# EAGLE design wiiceiver v2 (EAGLE 7.1.0)
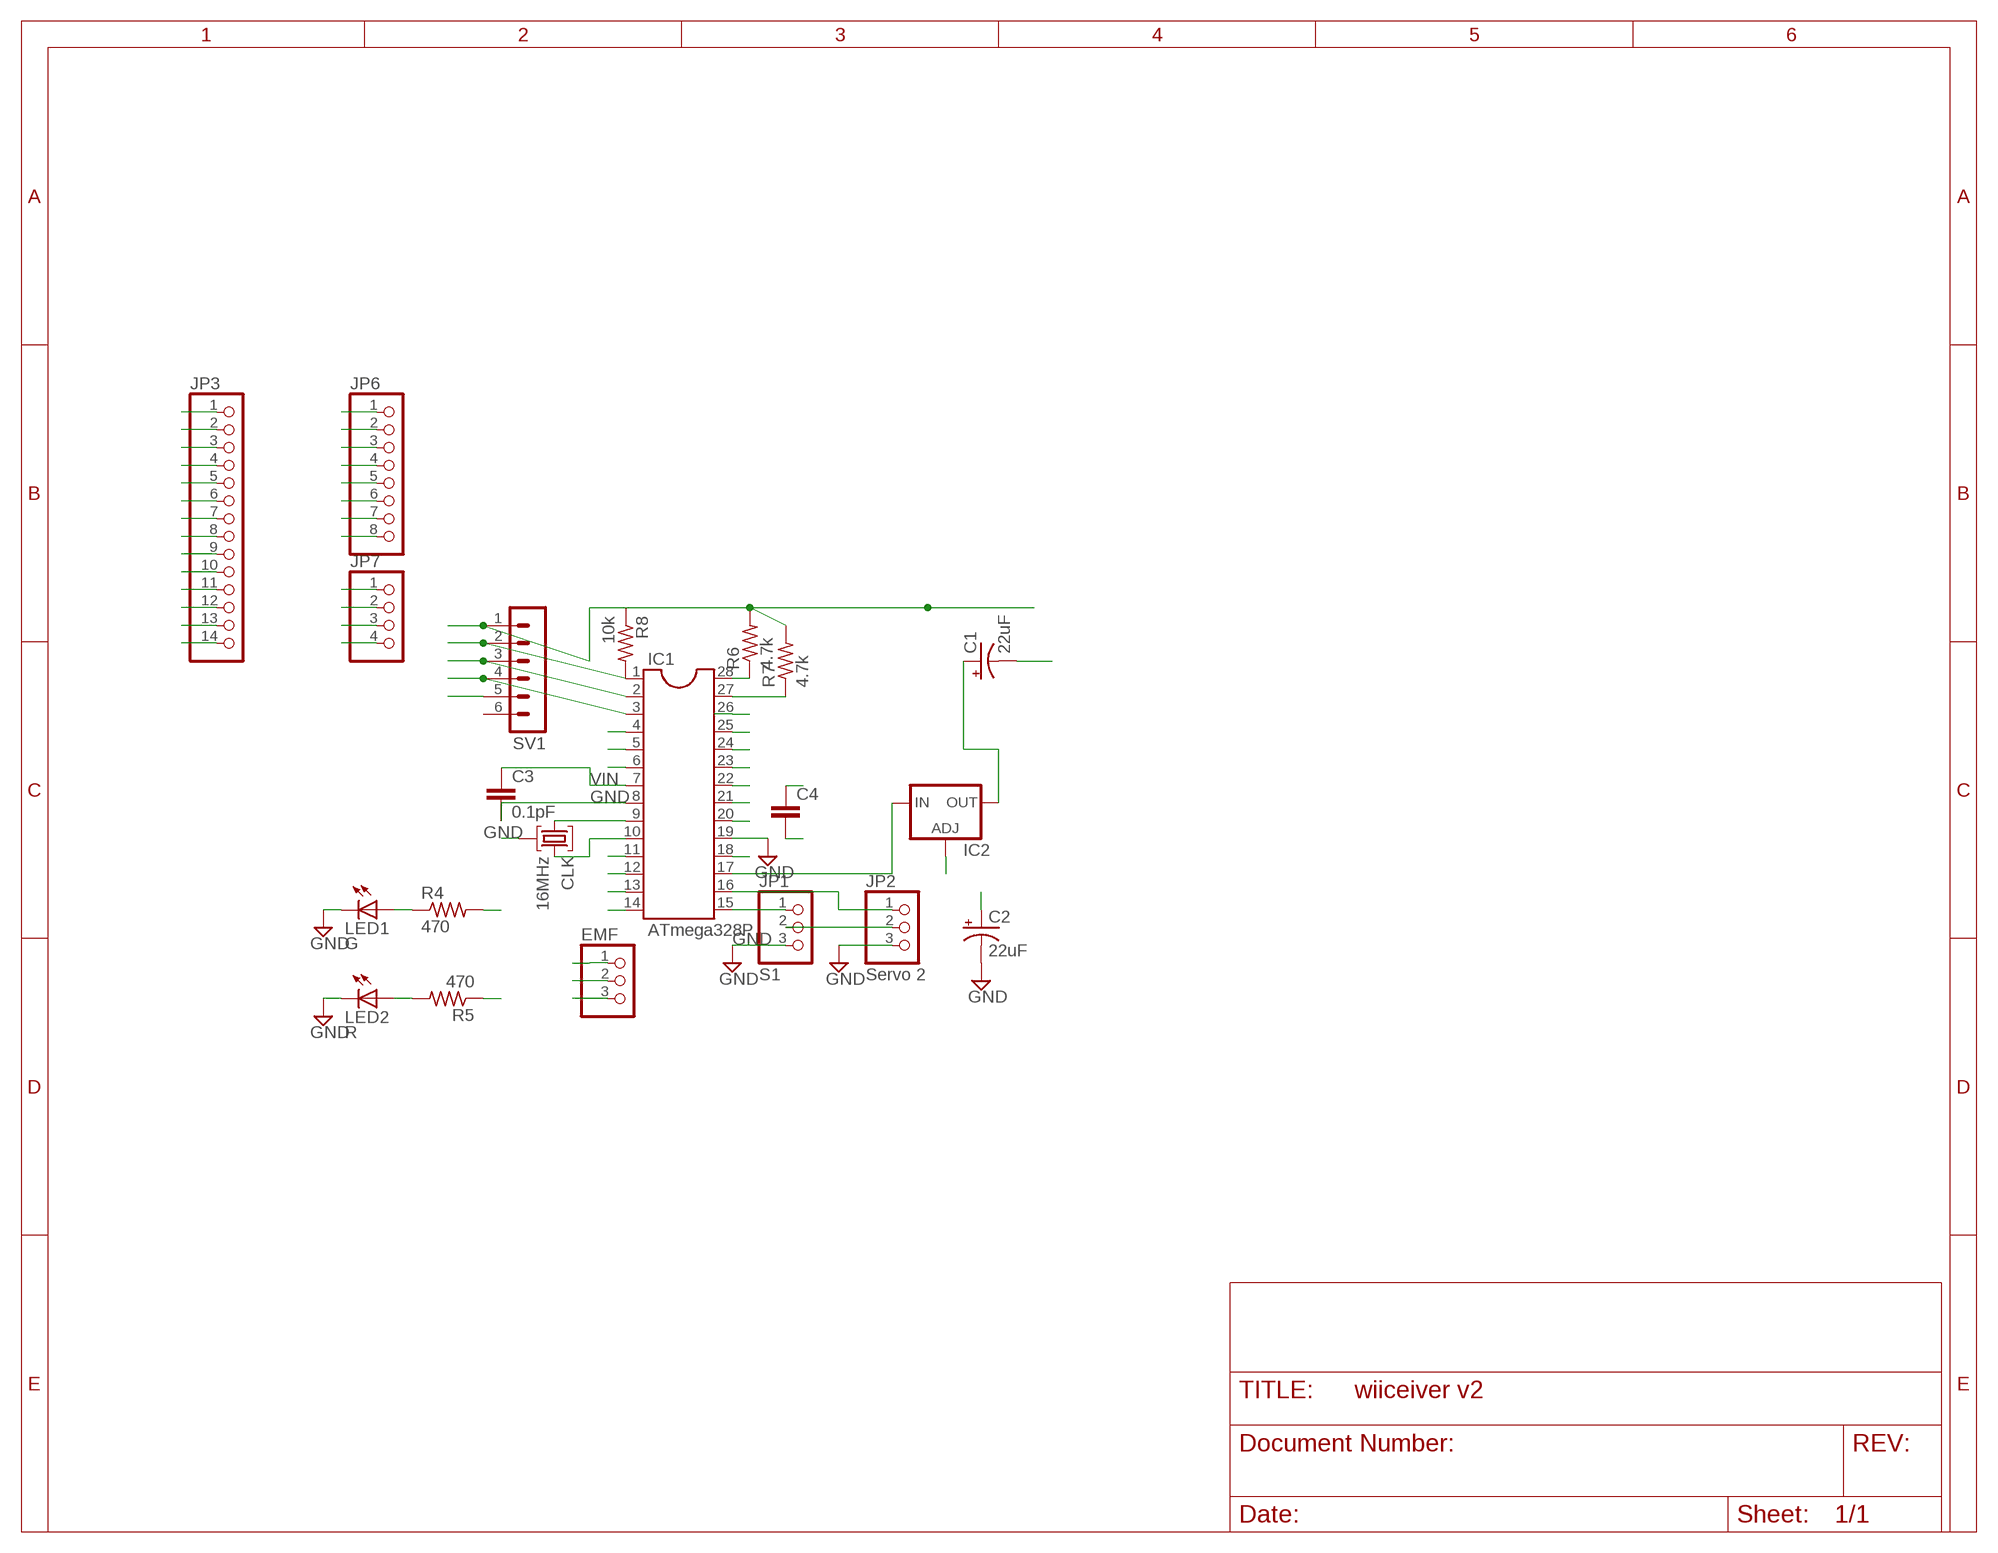
[diagram p0: schematic, sheet 1]

## Parts
C1  22uF  CPOL-USB45181A  [B45181A]
C2  22uF  CPOL-USB45181A  [B45181A]
C3  0.1pF  C5/2.5  [C5B2.5]
C4  C5/2.5  [C5B2.5]
CLK  16MHz  IXFA  [HC49U]
EMF  PINHD-1X3  [1X03]
IC1  ATmega328P  DIL28-3  [DIL28-3]
IC2  LM317TS  [317TS]
JP1  S1  PINHD-1X3  [1X03]
JP2  Servo 2  PINHD-1X3  [1X03]
JP3  PINHD-1X14  [1X14]
JP6  PINHD-1X8  [1X08]
JP7  PINHD-1X4  [1X04]
LED1  G  LED3MM  [LED3MM]
LED2  R  LED3MM  [LED3MM]
R4  470  R-US_0204/2V  [0204V]
R5  470  R-US_0204/2V  [0204V]
R6  4.7k  R-US_0204/2V  [0204V]
R7  4.7k  R-US_0204/2V  [0204V]
R8  10k  R-US_0204/2V  [0204V]
SV1  MA06-1  [MA06-1]

## Nets
A0: IC1.23 JP3.6
A1: IC1.24 JP3.5
A2: IC1.25 JP3.4
A3: IC1.26 JP3.3
A4: IC1.27 JP3.2 R7.1
A5: IC1.28 JP3.1 R6.1
D0: IC1.2 JP6.2 SV1.3
D1: IC1.3 JP6.3 SV1.4
D2: IC1.4 JP6.4
D3: IC1.5 JP6.5
D4: IC1.6 JP6.6
D5: IC1.11 JP7.1
D6: IC1.12 JP7.2 R4.2
D7: IC1.13 JP7.3
D8: IC1.14 JP7.4 R5.1
D9: IC1.15 JP1.1 JP3.14
D10: IC1.16 JP2.1 JP3.13
D11: IC1.17 IC2.3(IN) JP3.12
D12: IC1.18 JP3.11
D13: JP3.10
GND: C1.- C2.- C3.2 C4.2 CLK.2 EMF.2 IC1.8 IC1.19 IC1.22 IC2.1(ADJ) JP1.3 JP2.3 JP3.7 JP6.8 LED1.K(C) LED2.K(C) SV1.5
N$1: LED2.A R5.2
N$2: LED1.A R4.1
N$3: CLK.3 IC1.10
N$11: CLK.1 IC1.9
N$16: C1.+ IC2.2(OUT)
RST: IC1.1 JP6.1 R8.2 SV1.2
VIN: C3.1 C4.1 EMF.3 IC1.7 IC1.20 IC1.21 JP3.8 JP3.9 JP6.7 R6.2 R7.2 R8.1 SV1.1
VRAW: C2.+ EMF.1 JP1.2 JP2.2
Unconnected: SV1.6

## Library data of the parts
C1 C2 = resistor:CPOL-US: POLARIZED CAPACITOR, American symbol
C3 C4 = capacitor-wima:C: CAPACITOR naming: grid - package width
CLK = crystal:IXF: Crystal Filter Source: www.ilsiamerica.com .. C1 IXF Series.pdf; OC_FARNELL: unknown; OC_NEWARK: unknown
EMF JP1 JP2 = pinhead:PINHD-1X3: PIN HEADER
IC1 = ic-package:DIL28: Dual In Line
IC2 = v-reg:LM317TS: VOLTAGE REGULATOR
JP3 = pinhead:PINHD-1X14: PIN HEADER
JP6 = pinhead:PINHD-1X8: PIN HEADER
JP7 = pinhead:PINHD-1X4: PIN HEADER
LED1 LED2 = led:LED: LED OSRAM: - CHIPLED LG R971, LG N971, LY N971, LG Q971, LY Q971, LO R971, LY R971 LH N974, LH R974 LS Q976, LO Q976, LY Q976 LO Q996 - Hyper CHIPLED LW Q18S LB Q993, LB Q99A, LB R99A - SideLED LS A670, LO A670, LY A670, LG A670, LP A670 LB A673, LV A673, LT A673, LW A673 LH A674 LY A675 LS A676, LA A676, LO A676, LY A676, LW A676 LS A679, LY A679, LG A679 - Hyper Micro SIDELED® LS Y876, LA Y876, LO Y876, LY Y876 LT Y87S - SmartLED LW L88C, LW L88S LB L89C, LB L89S, LG L890 LS L89K, LO L89K, LY L89K LS L896, LA L896, LO L896, LY L896 - TOPLED LS T670, LO T670, LY T670, LG T670, LP T670 LSG T670, LSP T670, LSY T670, LOP T670, LYG T670 LG T671, LOG T671, LSG T671 LB T673, LV T673, LT T673, LW T673 LH T674 LS T676, LA T676, LO T676, LY T676, LB T676, LH T676, LSB T676, LW T676 LB T67C, LV T67C, LT T67C, LS T67K, LO T67K, LY T67K, LW E67C LS E67B, LA E67B, LO E67B, LY E67B, LB E67C, LV E67C, LT E67C LW T67C LS T679, LY T679, LG T679 LS T770, LO T770, LY T770, LG T770, LP T770 LB T773, LV T773, LT T773, LW T773 LH T774 LS E675, LA E675, LY E675, LS T675 LS T776, LA T776, LO T776, LY T776, LB T776 LHGB T686 LT T68C, LB T68C - Hyper Mini TOPLED® LB M676 - Mini TOPLED Santana® LG M470 LS M47K, LO M47K, LY M47K Source: http://www.osram.convergy.de LUXEON: - LUMILED® LXK2-PW12-R00, LXK2-PW12-S00, LXK2-PW14-U00, LXK2-PW14-V00 LXK2-PM12-R00, LXK2-PM12-S00, LXK2-PM14-U00 LXK2-PE12-Q00, LXK2-PE12-R00, LXK2-PE12-S00, LXK2-PE14-T00, LXK2-PE14-U00 LXK2-PB12-K00, LXK2-PB12-L00, LXK2-PB12-M00, LXK2-PB14-N00, LXK2-PB14-P00, LXK2-PB14-Q00 LXK2-PR12-L00, LXK2-PR12-M00, LXK2-PR14-Q00, LXK2-PR14-R00 LXK2-PD12-Q00, LXK2-PD12-R00, LXK2-PD12-S00 LXK2-PH12-R00, LXK2-PH12-S00 LXK2-PL12-P00, LXK2-PL12-Q00, LXK2-PL12-R00 Source: www.luxeon.com KINGBRIGHT: KA-3528ASYC Source: www.kingbright.com
R4-R8 = resistor:R-US_: RESISTOR, American symbol
SV1 = con-lstb:MA06-1: PIN HEADER; OC_FARNELL: unknown; OC_NEWARK: unknown

## Net classes
0 default: clearance 0.205 mm

## Board
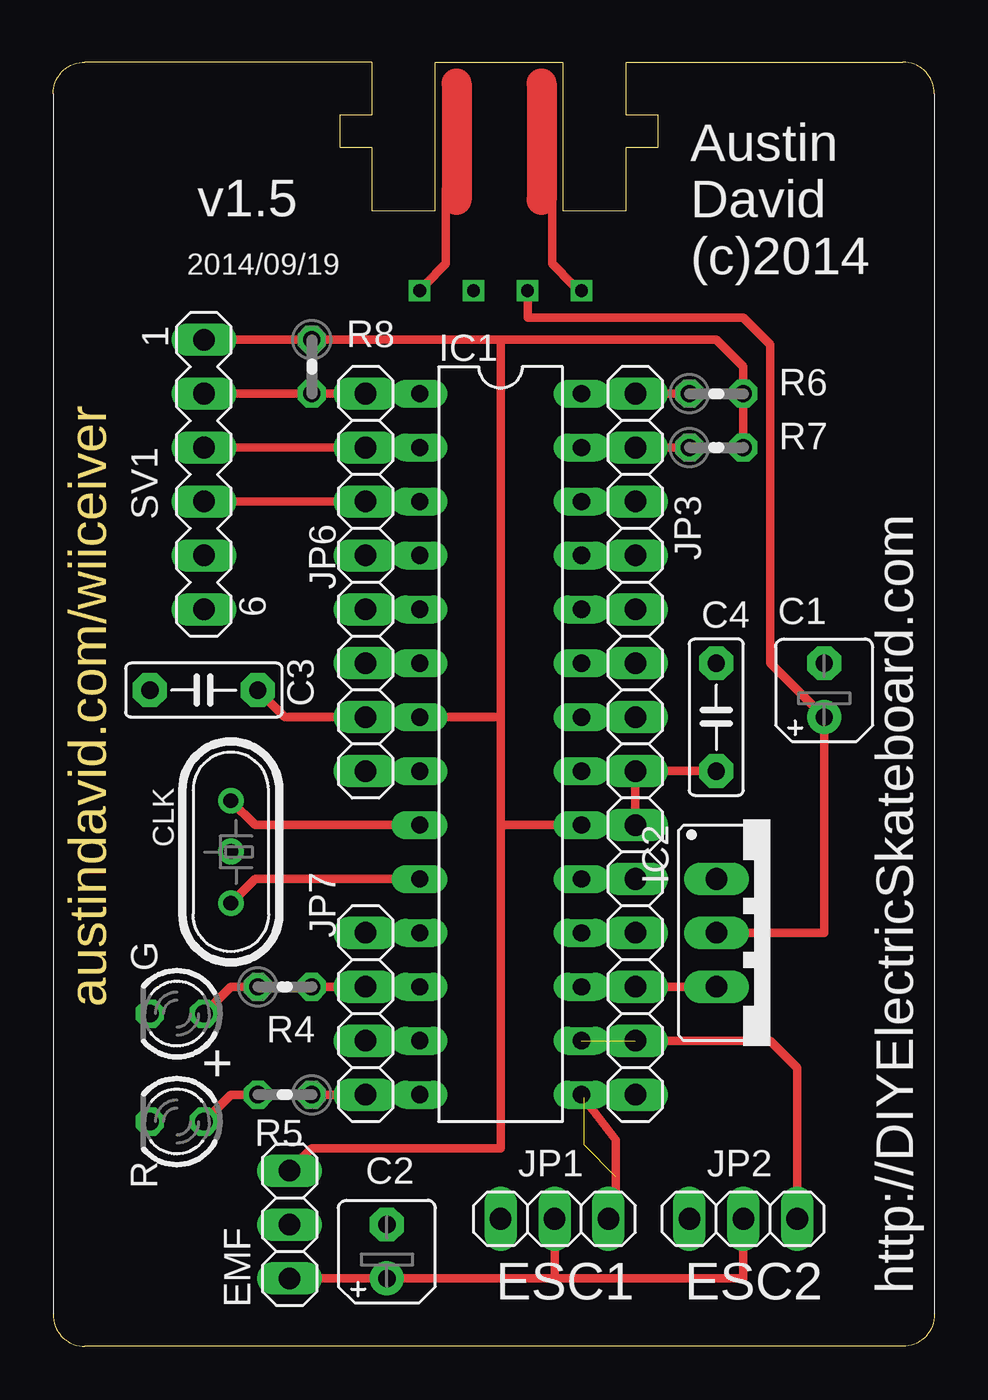
[diagram p1: board, top side]
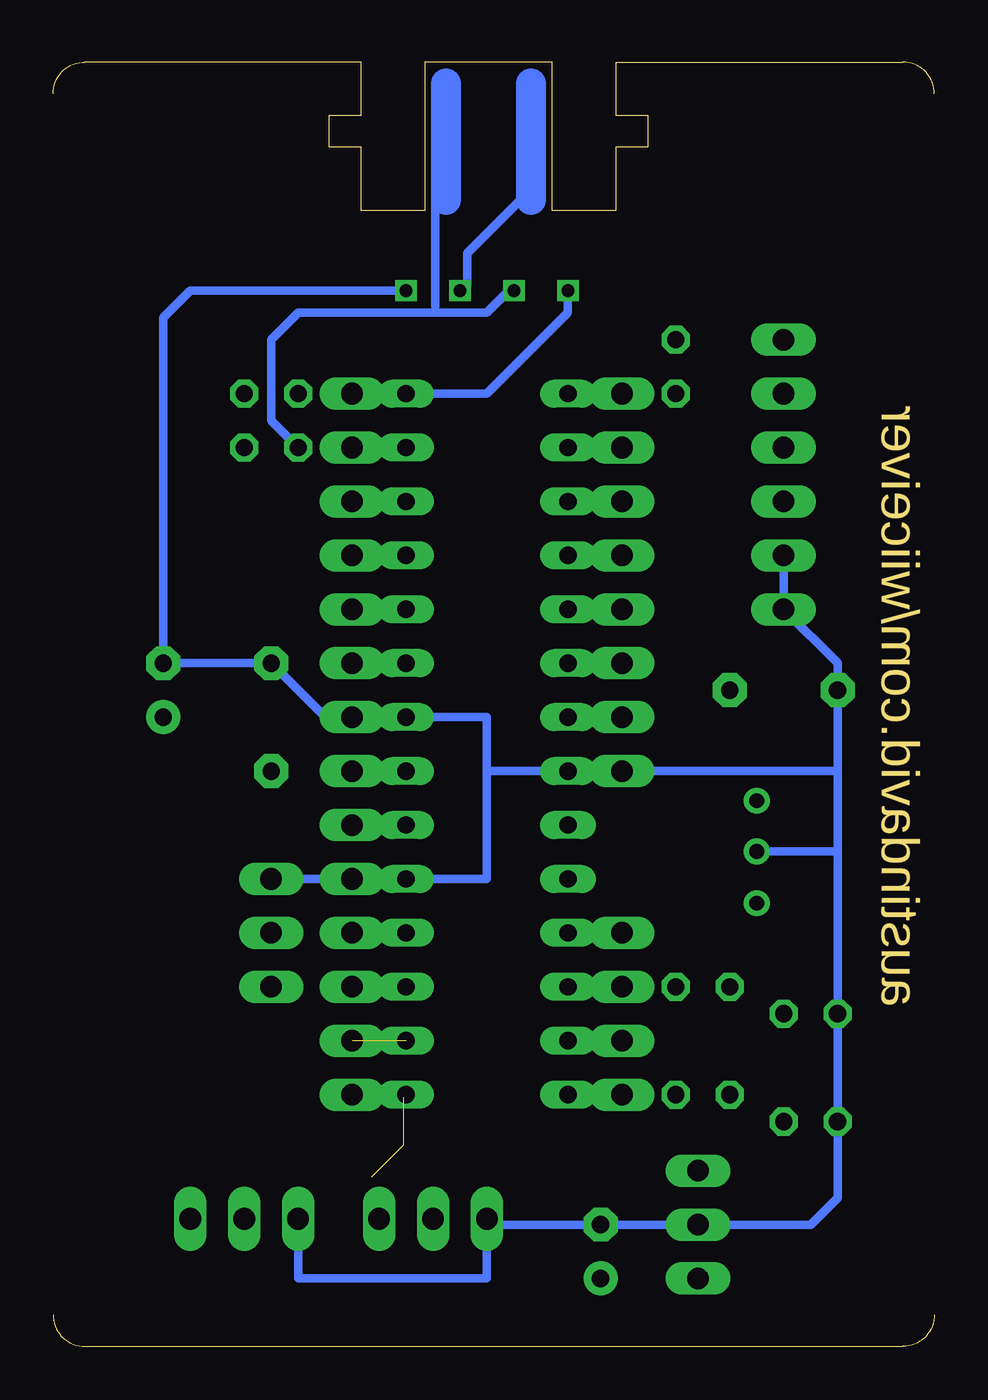
[diagram p2: board, bottom side, seen from below]

Size 41.5 x 60.5 mm. Coordinates in mm from the lower left corner, seen from the top.
Outline: 41.5,1.5 arc-90 40,0 1.5,0 arc-90 0,1.5
Outline: 0,59 arc-90 1.5,60.5 15,60.5 15,58 13.5,58 13.5,56.5 15,56.5 15,53.5 18,53.5 18,60.5 24,60.5 24,53.5 27,53.5 27,56.5 28.5,56.5 28.5,58 27,58 27,60.5 40,60.5 arc-90 41.5,59
Copper layers (1*16): Top 0.035mm / dielectric 1.5mm / Bottom 0.035mm
Design rules "default": minimum track width 10mil, minimum drill 24mil, track to track 8mil, track to pad 8mil, pad to pad 8mil, via to via 8mil, smd to smd 8mil, copper to edge 40mil, drill to drill 8mil, minimum pad ring 10mil, minimum via ring 8mil, stop-mask expansion 4mil, vias tented up to drill 0mil, thermal gap 10mil

### Footprints (pad centres in the part's own frame; a part is rotated, then mirrored left to right if it is on the bottom)
B45181A = drill 0.813 pad 1.6: + -1.27,0 | drill 0.813 pad 1.6 octagon: - 1.27,0
C5B2.5 = drill 0.813 pad 1.6 octagon: 1 -2.54,0; 2 2.54,0
HC49U = drill 0.7 pad 1.2: 1 -2.413,0; 2 -0.027,0; 3 2.413,0
1X03 = drill 1.016 long: 1 -2.54,0; 2 0,0; 3 2.54,0
DIL28-3 = drill 0.813 long: 1 -16.51,-3.81; 2 -13.97,-3.81; 3 -11.43,-3.81; 4 -8.89,-3.81; 5 -6.35,-3.81; 6 -3.81,-3.81; 7 -1.27,-3.81; 8 1.27,-3.81; 9 3.81,-3.81; 10 6.35,-3.81; 11 8.89,-3.81; 12 11.43,-3.81; 13 13.97,-3.81; 14 16.51,-3.81; 15 16.51,3.81; 16 13.97,3.81; 17 11.43,3.81; 18 8.89,3.81; 19 6.35,3.81; 20 3.81,3.81; 21 1.27,3.81; 22 -1.27,3.81; 23 -3.81,3.81; 24 -6.35,3.81; 25 -8.89,3.81; 26 -11.43,3.81; 27 -13.97,3.81; 28 -16.51,3.81
317TS = drill 1.016 long: 1 -2.54,-2.54; 2 0,-2.54; 3 2.54,-2.54
1X14 = drill 1.016 long: 1 -16.51,0; 2 -13.97,0; 3 -11.43,0; 4 -8.89,0; 5 -6.35,0; 6 -3.81,0; 7 -1.27,0; 8 1.27,0; 9 3.81,0; 10 6.35,0; 11 8.89,0; 12 11.43,0; 13 13.97,0; 14 16.51,0
1X08 = drill 1.016 long: 1 -8.89,0; 2 -6.35,0; 3 -3.81,0; 4 -1.27,0; 5 1.27,0; 6 3.81,0; 7 6.35,0; 8 8.89,0
1X04 = drill 1.016 long: 1 -3.81,0; 2 -1.27,0; 3 1.27,0; 4 3.81,0
LED3MM = drill 0.813 octagon: A -1.27,0; K 1.27,0
0204V = drill 0.813 octagon: 1 -1.27,0; 2 1.27,0
MA06-1 = drill 1.016 long: 1 -6.35,0; 2 -3.81,0; 3 -1.27,0; 4 1.27,0; 5 3.81,0; 6 6.35,0

### Placement (x,y rotation side)
C1  36.31,30.91 90 top
C2  15.72,4.47 90 top
C3  7.1,30.91 180 top
C4  31.23,29.64 90 top
CLK  8.37,23.29 270 top
EMF  11.14,5.74 90 top
IC1  21.07,28.37 270 top
IC2  33.77,19.48 270 top
JP1  23.61,6.01 180 top
JP2  32.5,6.01 180 top
JP3  27.42,28.37 270 top
JP6  14.72,35.99 270 top
JP7  14.72,15.67 270 top
LED1  5.83,15.67 180 top
LED2  5.83,10.59 180 top
R4  10.91,16.94 0 top
R5  10.91,11.86 180 top
R6  31.23,44.88 0 top
R7  31.23,42.34 0 top
R8  12.18,46.15 270 top
SV1  7.1,41.07 270 top

### Tracks (layer width: path | path; a pad name or v marks a point on that pad's centre or on a via)
A0
  Top 0.406: IC1.23 JP3.6
A1
  Top 0.406: IC1.24 JP3.5
A2
  Top 0.406: IC1.25 JP3.4
A3
  Top 0.406: IC1.26 JP3.3
A4  (via drill 0.6)
  Top 0.406: R7.1 JP3.2 IC1.27
  Bottom 0.406: R7.1 31.23,43.61 31.23,47.42 29.96,48.69 21.07,48.69 19.8,49.96 v19.8,49.73
A5  (via drill 0.6)
  Top 0.406: IC1.28 JP3.1 R6.1
  Bottom 0.406: IC1.28 21.07,44.88 17.26,48.69 v17.26,49.73
D0
  Top 0.406: IC1.2 JP6.2 SV1.3
D1
  Top 0.406: IC1.3 JP6.3 SV1.4
D2
  Top 0.406: IC1.4 JP6.4
D3
  Top 0.406: IC1.5 JP6.5
D4
  Top 0.406: IC1.6 JP6.6
D5
  Top 0.406: IC1.11 JP7.1
D6
  Top 0.406: IC1.12 JP7.2 R4.2
D7
  Top 0.406: IC1.13 JP7.3
D8
  Top 0.406: IC1.14 JP7.4 R5.1
D9  (3 unrouted)
  Top 0.406: IC1.15 JP3.14 | 25,11.74 IC1.15 | 26.5,5.51 26.5,9.74 IC1.15
  Bottom 0.406: JP1.1 26.5,5.51
D10  (1 unrouted)
  Top 0.406: JP3.13 33.77,14.4 35.04,13.13 JP2.1
D11
  Top 0.406: IC1.17 JP3.12 IC2.3
D12
  Top 0.406: IC1.18 JP3.11
GND  (via drill 0.6)
  Top 0.406: IC1.8 JP6.8 | IC1.19 27.42,22.02
  Bottom 0.406: IC1.8 21.07,27.1 | JP6.8 4.56,27.1 | 4.56,27.1 C3.2 4.56,32.18 7.1,34.72 SV1.5 | CLK.2 4.59,23.32 4.56,23.29 | 4.56,23.29 4.56,27.1 | 4.56,23.29 LED1.K LED2.K 4.56,7.01 5.83,5.74 EMF.2 C2.- 21.07,5.74 | IC2.1 IC1.19 21.07,22.02 21.07,27.1 | 21.07,27.1 21.07,29.64 IC1.22 JP3.7 28.69,29.64 C4.2 C1.- 36.31,48.46 35.04,49.73 v24.88,49.73 | JP2.3 29.96,3.2 21.07,3.2 21.07,5.74 | 21.07,5.74 JP1.3
N$1
  Top 0.406: R5.2 8.37,11.86 LED2.A
N$2
  Top 0.406: R4.1 8.37,16.94 LED1.A
N$3
  Top 0.406: IC1.10 9.51,22.02 CLK.3
N$4
  Top 1.422: 19,59.5 19,54
N$5
  Bottom 1.422: 19,59.5 19,54
N$6
  Top 1.422: 23,59.5 23,54
N$7
  Bottom 1.422: 23,59.5 23,54
N$8
  Top 0.406: 17.5,50 18.5,51 18.5,54.5
N$9
  Top 0.406: 24.5,50 23.5,51 23.5,55.5
N$10
  Bottom 0.406: 22,50 22,51.5 19.5,54
N$11
  Top 0.406: IC1.9 9.51,24.56 CLK.1
N$13
  Bottom 0.406: 23.5,49 23.5,54
N$16  (via drill 0.6)
  Top 0.406: IC2.2 36.31,19.48 C1.+ 33.77,32.18 33.77,47.19 32.5,48.46 22.34,48.46 v22.34,49.73
RST
  Top 0.406: IC1.1 JP6.1 R8.2 SV1.2
VIN
  Top 0.406: SV1.1 R8.1 21.07,47.42 | R7.2 R6.2 32.5,46.15 31.23,47.42 21.07,47.42 | C4.1 JP3.8 | JP3.8 IC1.21 | JP3.8 JP3.9 IC1.20 21.07,24.56 | C3.1 10.91,29.64 JP6.7 IC1.7 21.07,29.64 | EMF.3 12.18,9.32 21.07,9.32 21.07,24.56 | 21.07,24.56 21.07,29.64 | 21.07,47.42 21.07,29.64
VRAW
  Top 0.406: 23.61,3.2 C2.+ EMF.1 | 23.61,3.2 JP1.2 | JP2.2 32.5,3.2 23.61,3.2

### Text on the board
Dimension: austindavid.com/wiiceiver
tNames: v1.5 | 2014/09/19 | Austin / David / (c)2014 | + | http://DIYElectricSkateboard.com | ESC1 | ESC2